# Altium schematic sheet HEADER.SchDoc: HEADER
size A3; Date: 13/11/2025; DrawnBy: Văn Quý Tuân; Revision: 1; SheetNumber: 10; SheetTotal: 10; Subsystem: HW-11/11/25; Size: A3
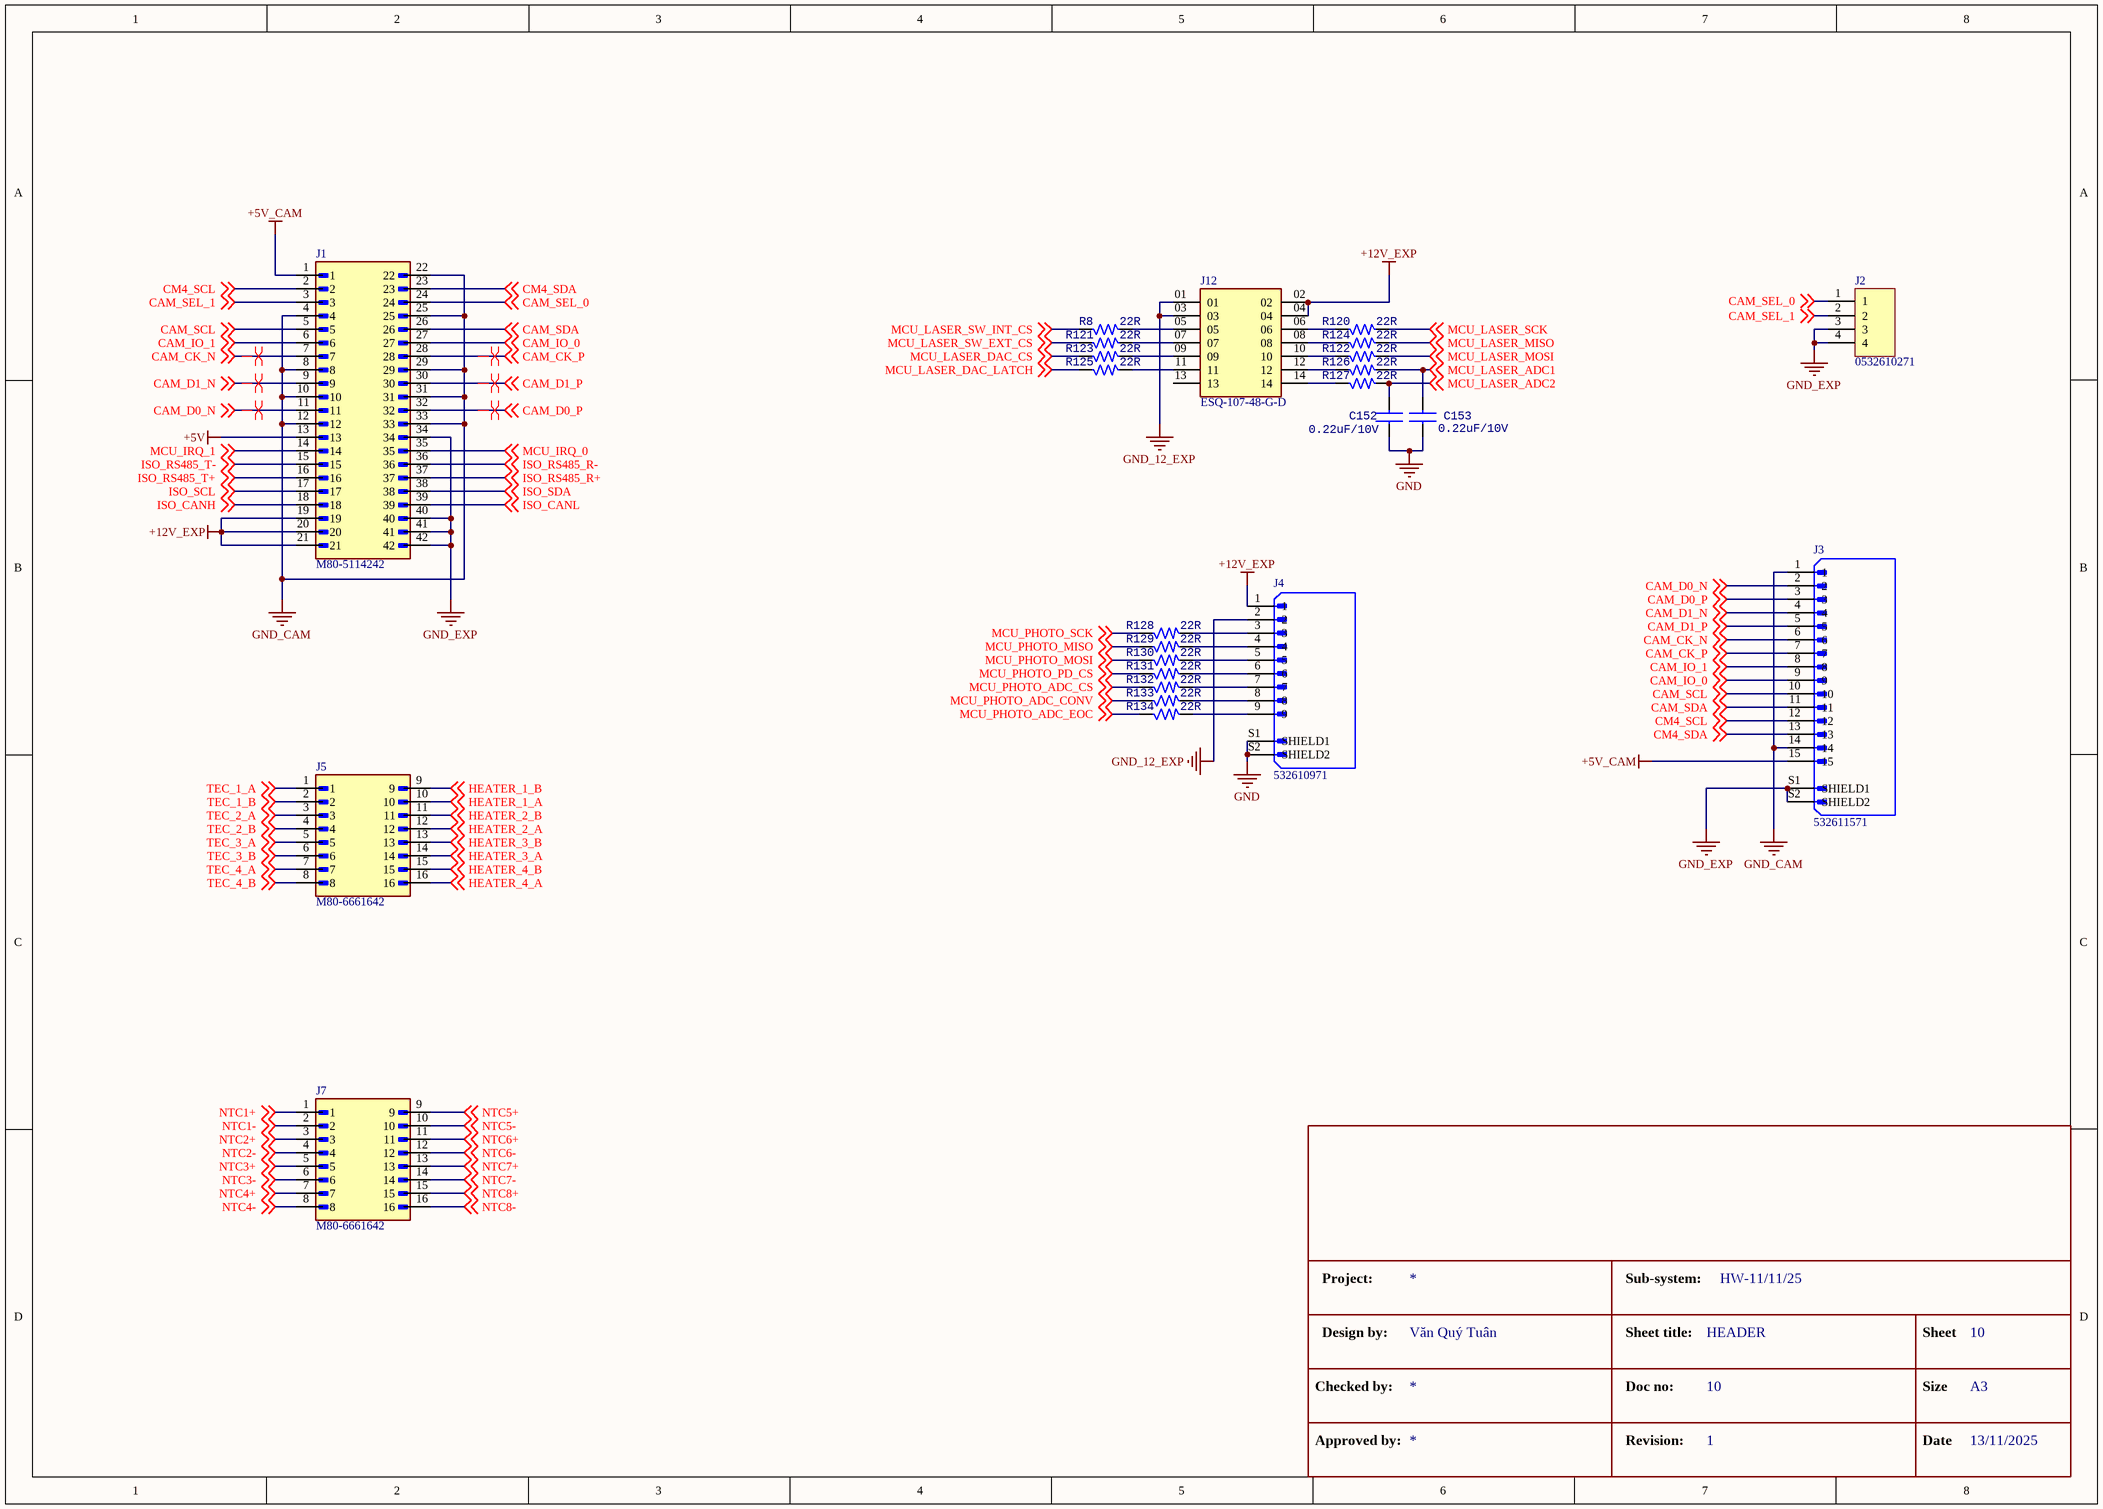
[diagram p0: HEADER.SchDoc]

## Parts
C152  0.22uF/10V  [CAP-CER-0603]
C153  0.22uF/10V  [CAP-CER-0603]
J1  M80-5114242  [HARWIN_M80-5114242]
J2  0532610271  [CON4_653104131822_SMD]
J3  532611571  [MOLEX_532611571]
J4  532610971  [MOLEX_532610971]
J5  M80-6661642  [HARWIN_M80-6661642]
J7  M80-6661642  [HARWIN_M80-6661642]
J12  ESQ-107-48-G-D  [SAMTEC_ESQ-107-48-G-D]
R8  22R  [RES-SMD-0603]
R120  22R  [RES-SMD-0603]
R121  22R  [RES-SMD-0603]
R122  22R  [RES-SMD-0603]
R123  22R  [RES-SMD-0603]
R124  22R  [RES-SMD-0603]
R125  22R  [RES-SMD-0603]
R126  22R  [RES-SMD-0603]
R127  22R  [RES-SMD-0603]
R128  22R  [RES-SMD-0603]
R129  22R  [RES-SMD-0603]
R130  22R  [RES-SMD-0603]
R131  22R  [RES-SMD-0603]
R132  22R  [RES-SMD-0603]
R133  22R  [RES-SMD-0603]
R134  22R  [RES-SMD-0603]

## Nets
+5V: J1.13
+5V_CAM: J1.1 J3.15
+12V_EXP: J1.19 J1.20 J1.21 J4.1 J12.02 J12.04
GND: C152.2 C153.2 J4.S1(SHIELD1) J4.S2(SHIELD2)
GND_12_EXP: J4.2 J12.01 J12.03
GND_CAM: J1.4 J1.8 J1.10 J1.12 J1.22 J1.25 J1.29 J1.31 J1.33 J3.1 J3.14
GND_EXP: J1.34 J1.40 J1.41 J1.42 J2.3 J2.4 J3.S1(SHIELD1) J3.S2(SHIELD2)
CAM_CK_N: J1.7 J3.6 ; off-sheet CAM_CK_N
CAM_CK_P: J1.28 J3.7 ; off-sheet CAM_CK_P
CAM_D0_N: J1.11 J3.2 ; off-sheet CAM_D0_N
CAM_D0_P: J1.32 J3.3 ; off-sheet CAM_D0_P
CAM_D1_N: J1.9 J3.4 ; off-sheet CAM_D1_N
CAM_D1_P: J1.30 J3.5 ; off-sheet CAM_D1_P
CAM_IO_0: J1.27 J3.9 ; off-sheet CAM_IO_0
CAM_IO_1: J1.6 J3.8 ; off-sheet CAM_IO_1
CAM_SCL: J1.5 J3.10 ; off-sheet CAM_SCL
CAM_SDA: J1.26 J3.11 ; off-sheet CAM_SDA
CAM_SEL_0: J1.24 J2.1 ; off-sheet CAM_SEL_0
CAM_SEL_1: J1.3 J2.2 ; off-sheet CAM_SEL_1
CM4_SCL: J1.2 J3.12 ; off-sheet CM4_SCL
CM4_SDA: J1.23 J3.13 ; off-sheet CM4_SDA
HEATER_1_A: J5.10 ; off-sheet HEATER_1_A
HEATER_1_B: J5.9 ; off-sheet HEATER_1_B
HEATER_2_A: J5.12 ; off-sheet HEATER_2_A
HEATER_2_B: J5.11 ; off-sheet HEATER_2_B
HEATER_3_A: J5.14 ; off-sheet HEATER_3_A
HEATER_3_B: J5.13 ; off-sheet HEATER_3_B
HEATER_4_A: J5.16 ; off-sheet HEATER_4_A
HEATER_4_B: J5.15 ; off-sheet HEATER_4_B
ISO_CANH: J1.18 ; off-sheet ISO_CANH
ISO_CANL: J1.39 ; off-sheet ISO_CANL
ISO_RS485_R+: J1.37 ; off-sheet ISO_RS485_R+
ISO_RS485_R-: J1.36 ; off-sheet ISO_RS485_R-
ISO_RS485_T+: J1.16 ; off-sheet ISO_RS485_T+
ISO_RS485_T-: J1.15 ; off-sheet ISO_RS485_T-
ISO_SCL: J1.17 ; off-sheet ISO_SCL
ISO_SDA: J1.38 ; off-sheet ISO_SDA
MCU_IRQ_0: J1.35 ; off-sheet MCU_IRQ_0
MCU_IRQ_1: J1.14 ; off-sheet MCU_IRQ_1
MCU_LASER_ADC1: C153.1 R126.2 ; off-sheet MCU_LASER_ADC1
MCU_LASER_ADC2: C152.1 R127.2 ; off-sheet MCU_LASER_ADC2
MCU_LASER_DAC_CS: R123.1 ; off-sheet MCU_LASER_DAC_CS
MCU_LASER_DAC_LATCH: R125.1 ; off-sheet MCU_LASER_DAC_LATCH
MCU_LASER_MISO: R124.2 ; off-sheet MCU_LASER_MISO
MCU_LASER_MOSI: R122.2 ; off-sheet MCU_LASER_MOSI
MCU_LASER_SCK: R120.2 ; off-sheet MCU_LASER_SCK
MCU_LASER_SW_EXT_CS: R121.1 ; off-sheet MCU_LASER_SW_EXT_CS
MCU_LASER_SW_INT_CS: R8.1 ; off-sheet MCU_LASER_SW_INT_CS
MCU_PHOTO_ADC_CONV: R133.1 ; off-sheet MCU_PHOTO_ADC_CONV
MCU_PHOTO_ADC_CS: R132.1 ; off-sheet MCU_PHOTO_ADC_CS
MCU_PHOTO_ADC_EOC: R134.1 ; off-sheet MCU_PHOTO_ADC_EOC
MCU_PHOTO_MISO: R129.1 ; off-sheet MCU_PHOTO_MISO
MCU_PHOTO_MOSI: R130.1 ; off-sheet MCU_PHOTO_MOSI
MCU_PHOTO_PD_CS: R131.1 ; off-sheet MCU_PHOTO_PD_CS
MCU_PHOTO_SCK: R128.1 ; off-sheet MCU_PHOTO_SCK
NTC1+: J7.1 ; off-sheet NTC1+
NTC1-: J7.2 ; off-sheet NTC1-
NTC2+: J7.3 ; off-sheet NTC2+
NTC2-: J7.4 ; off-sheet NTC2-
NTC3+: J7.5 ; off-sheet NTC3+
NTC3-: J7.6 ; off-sheet NTC3-
NTC4+: J7.7 ; off-sheet NTC4+
NTC4-: J7.8 ; off-sheet NTC4-
NTC5+: J7.9 ; off-sheet NTC5+
NTC5-: J7.10 ; off-sheet NTC5-
NTC6+: J7.11 ; off-sheet NTC6+
NTC6-: J7.12 ; off-sheet NTC6-
NTC7+: J7.13 ; off-sheet NTC7+
NTC7-: J7.14 ; off-sheet NTC7-
NTC8+: J7.15 ; off-sheet NTC8+
NTC8-: J7.16 ; off-sheet NTC8-
TEC_1_A: J5.1 ; off-sheet TEC_1_A
TEC_1_B: J5.2 ; off-sheet TEC_1_B
TEC_2_A: J5.3 ; off-sheet TEC_2_A
TEC_2_B: J5.4 ; off-sheet TEC_2_B
TEC_3_A: J5.5 ; off-sheet TEC_3_A
TEC_3_B: J5.6 ; off-sheet TEC_3_B
TEC_4_A: J5.7 ; off-sheet TEC_4_A
TEC_4_B: J5.8 ; off-sheet TEC_4_B
NetJ4_3: J4.3 R128.2
NetJ4_4: J4.4 R129.2
NetJ4_5: J4.5 R130.2
NetJ4_6: J4.6 R131.2
NetJ4_7: J4.7 R132.2
NetJ4_8: J4.8 R133.2
NetJ4_9: J4.9 R134.2
NetJ12_05: J12.05 R8.2
NetJ12_06: J12.06 R120.1
NetJ12_07: J12.07 R121.2
NetJ12_08: J12.08 R124.1
NetJ12_09: J12.09 R123.2
NetJ12_10: J12.10 R122.1
NetJ12_11: J12.11 R125.2
NetJ12_12: J12.12 R126.1
NetJ12_14: J12.14 R127.1

Not connected (* = marked no-connect by the designer): J12 13

## Layout directives
differential pair: CAM_CK_N, CAM_CK_P, CAM_D0_N, CAM_D0_P, CAM_D1_N, CAM_D1_P

## Notes on the sheet
- Project:
- Sub-system:
- Checked by:
- Design by:
- Sheet title:
- Doc no:
- Sheet
- Size
- Approved by:
- Revision:
- Date
- Text

## Library data of the parts
C152 C153 = CAP-CER
J2 = CON-PLG_4X1-50-RA-SMD: 4 Pins, 1 Row 1.25mm Pitch, right angle Connector, male; Manufacturer: WE; Manufacturer Part Number: 653104131822; Mating Part Number: 653004113322; Crimp Part Number: 65300113722DEC; Alternate Part Number-1: NA; Case/Package: TH-CON; Supplier-1: WURTH; Supplier Part Number-1: 653104131822
J3 = 532611571: Conn Shrouded Header (4 Sides) HDR 15 POS 1.25mm Solder RA Side Entry SMD PicoBladeâ„¢ T/R; MF: Molex; SnapEDA_Link: https://www.snapeda.com/parts/532611571/Molex/view-part/?ref=snap; Package: None; Value: *; MP: 532611571; Check_prices: https://www.snapeda.com/parts/532611571/Molex/view-part/?ref=eda
R8 R120-R134 = RES-SMD
J1 = M80-5114242: Package: None; Price: None; Value: *; MP: M80-5114242; Availability: Unavailable
J4 = 532610971: Price: None; Value: *; Availability: Unavailable; Package: None; MP: 532610971
J5 J7 = M80-6661642: Package: None; Price: None; Value: *; MP: M80-6661642; Availability: Unavailable
J12 = ESQ-107-48-G-D: Value: *; Package: None; Price: None; MP: ESQ-107-48-G-D; Availability: Unavailable